# Altium schematic sheet Sheet1.SchDoc: Digital Signal Controller Eval
size D; DrawnBy: Daud Zoss; Engineer: Daud Zoss; Organization: Daud Zoss; Address1: 14955 Avenida Venusto; Address2: Unit 85; Address3: San Diego, California; Address4: 92128 USA; DocumentNumber: N/A; Revision: 0; SheetNumber: 1; SheetTotal: 1
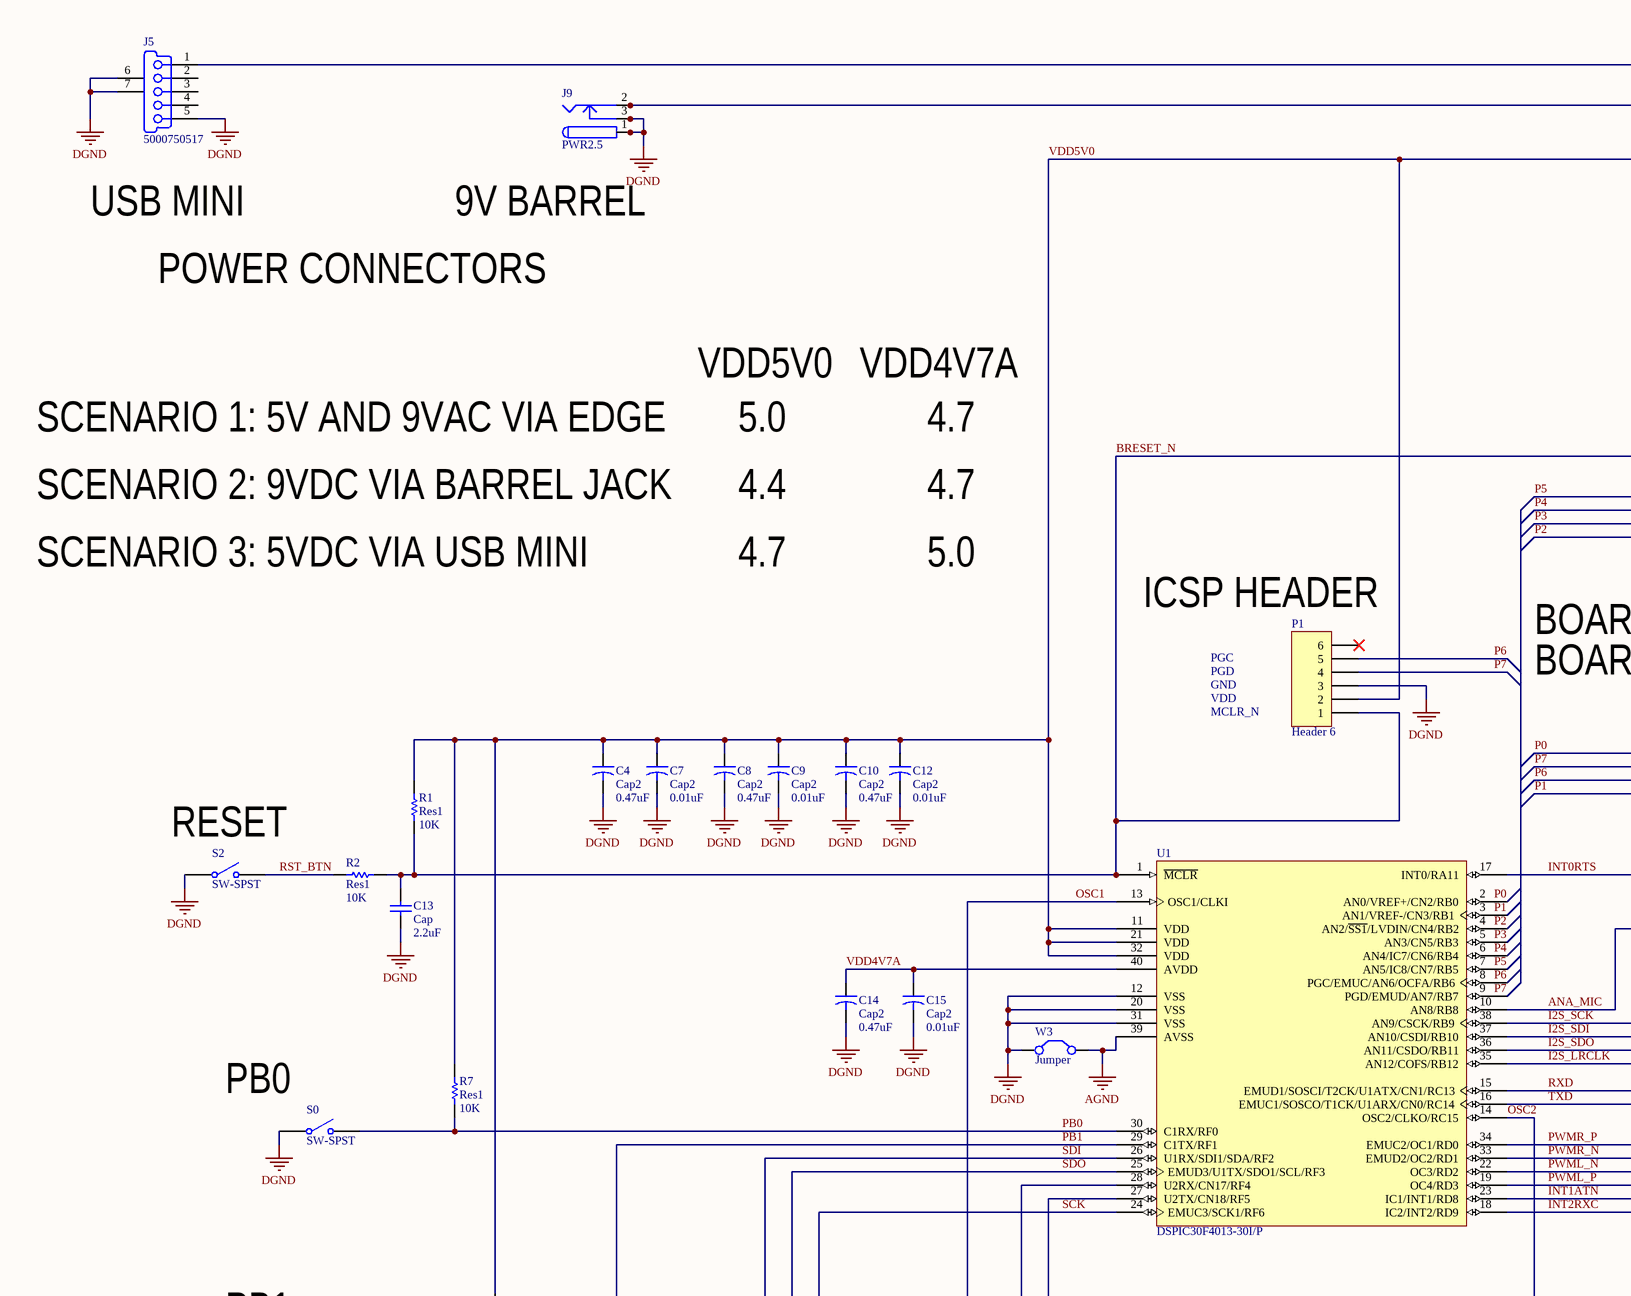
[diagram p0: Sheet1.SchDoc, top left]
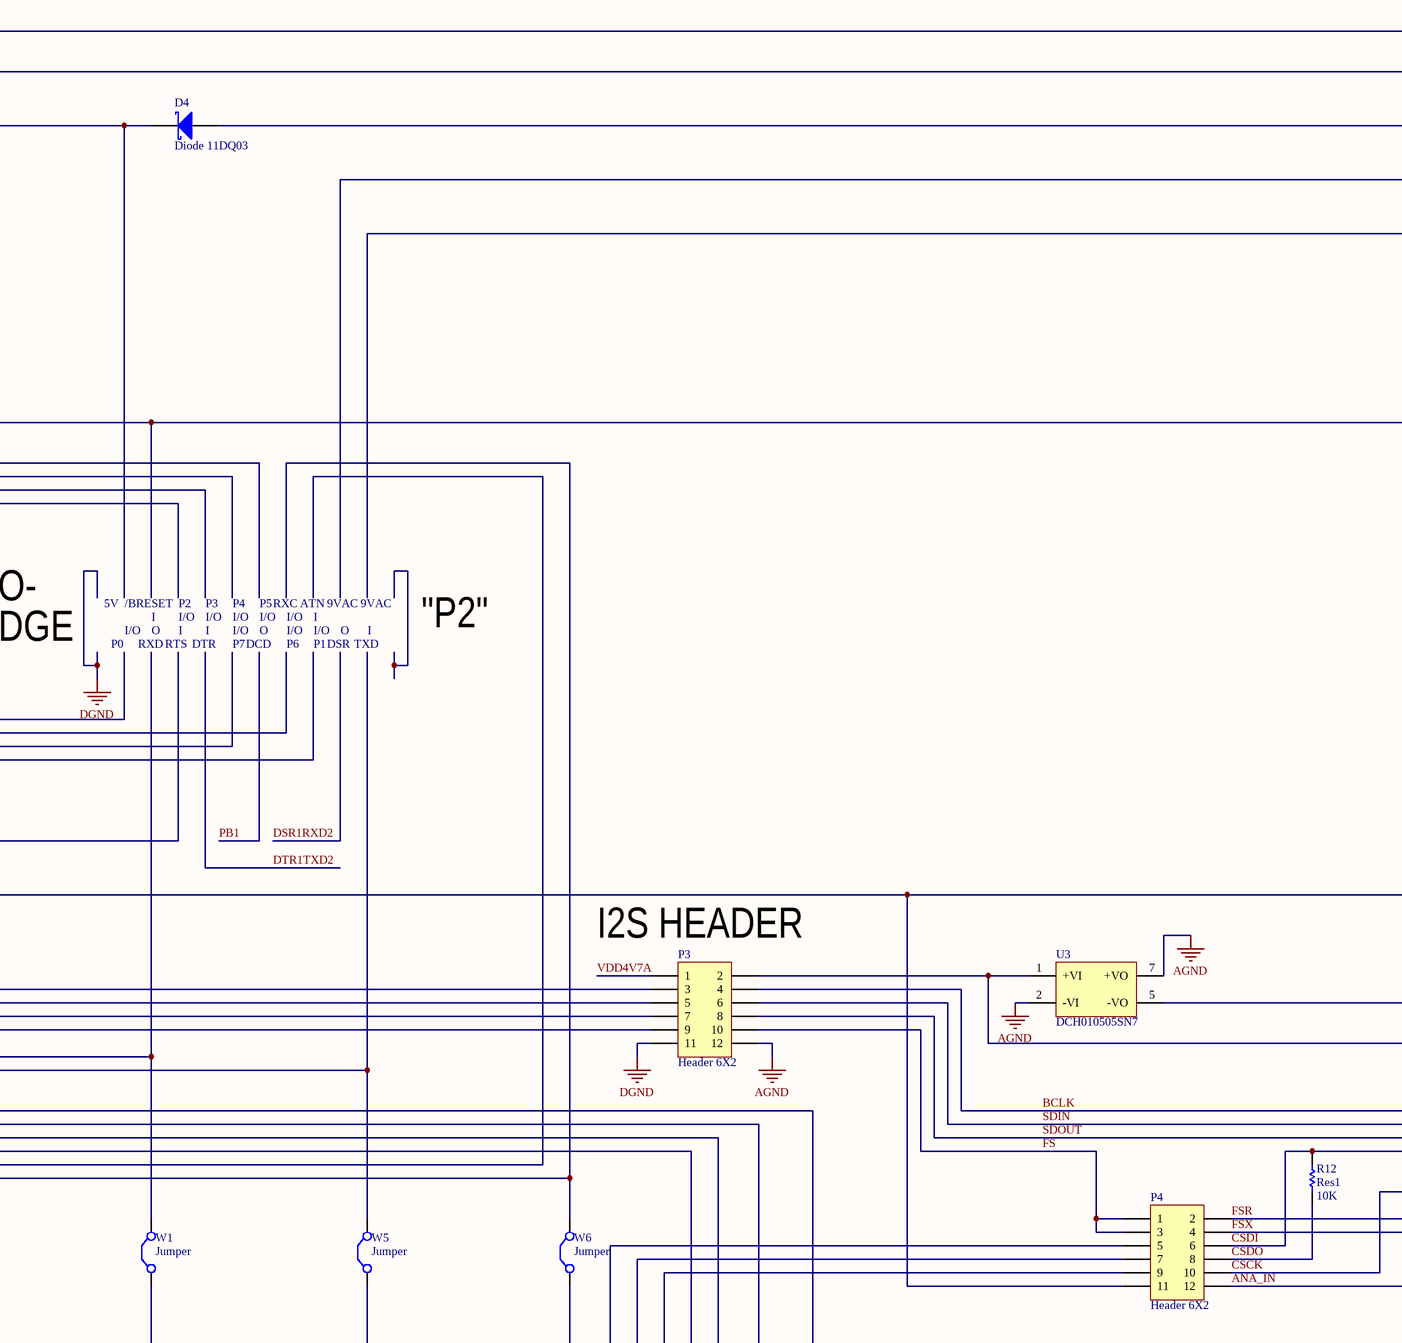
[diagram p1: Sheet1.SchDoc, top middle]
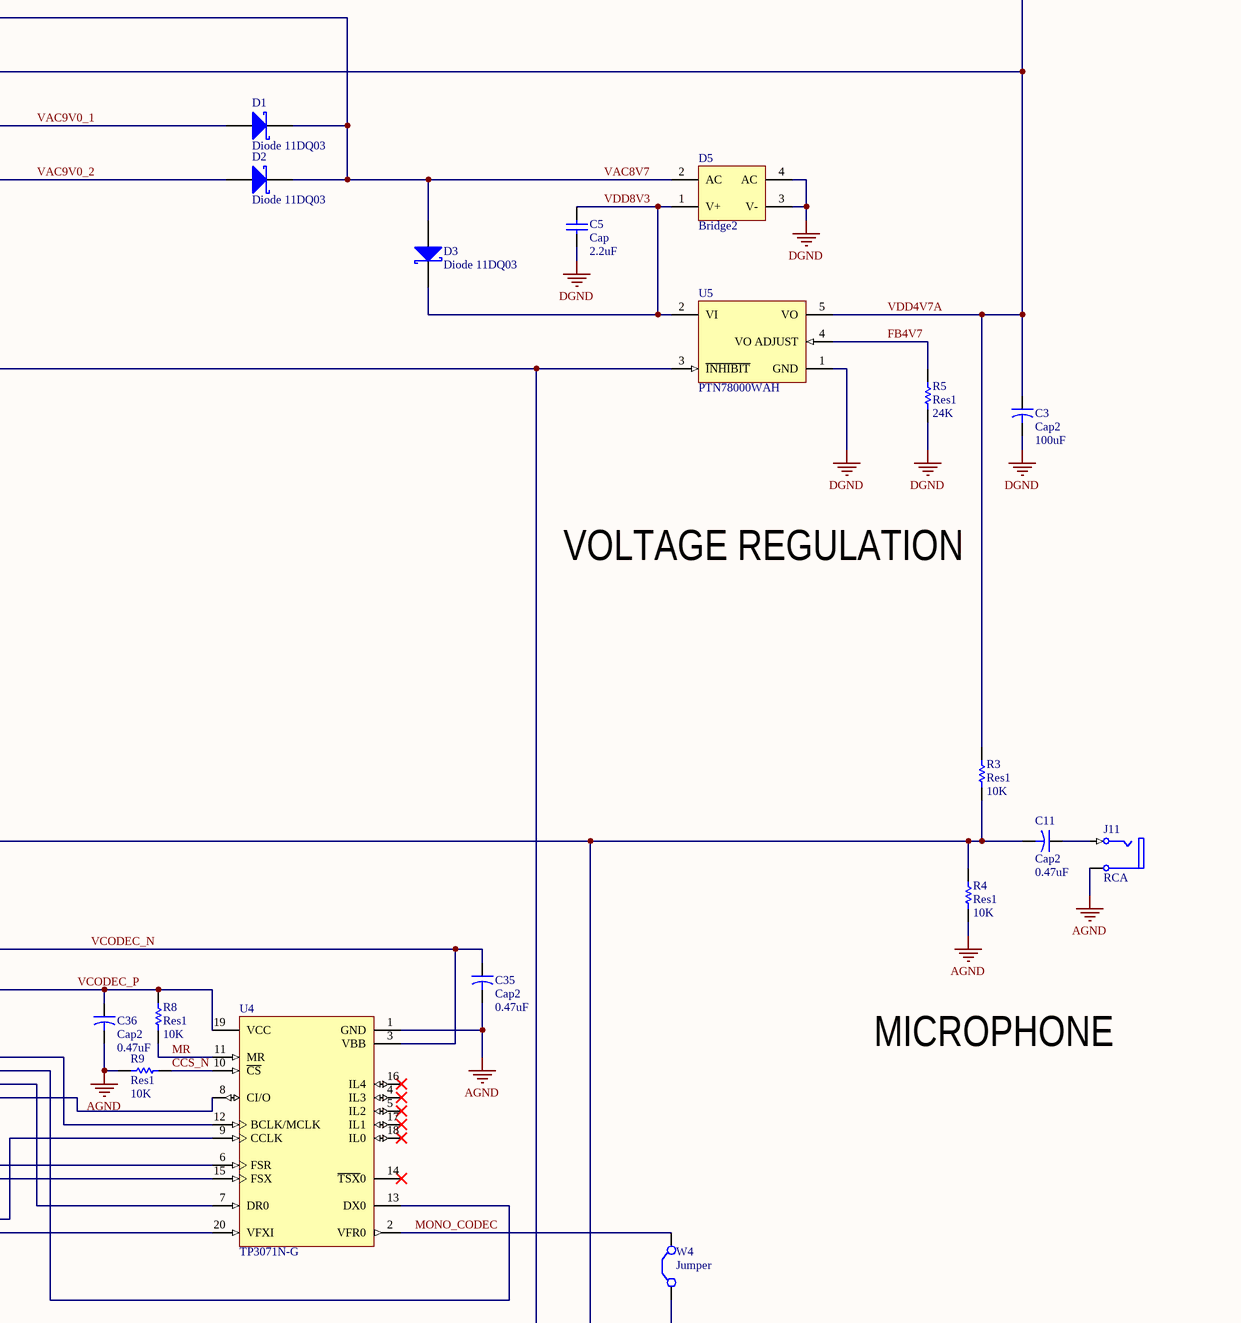
[diagram p2: Sheet1.SchDoc, top right]
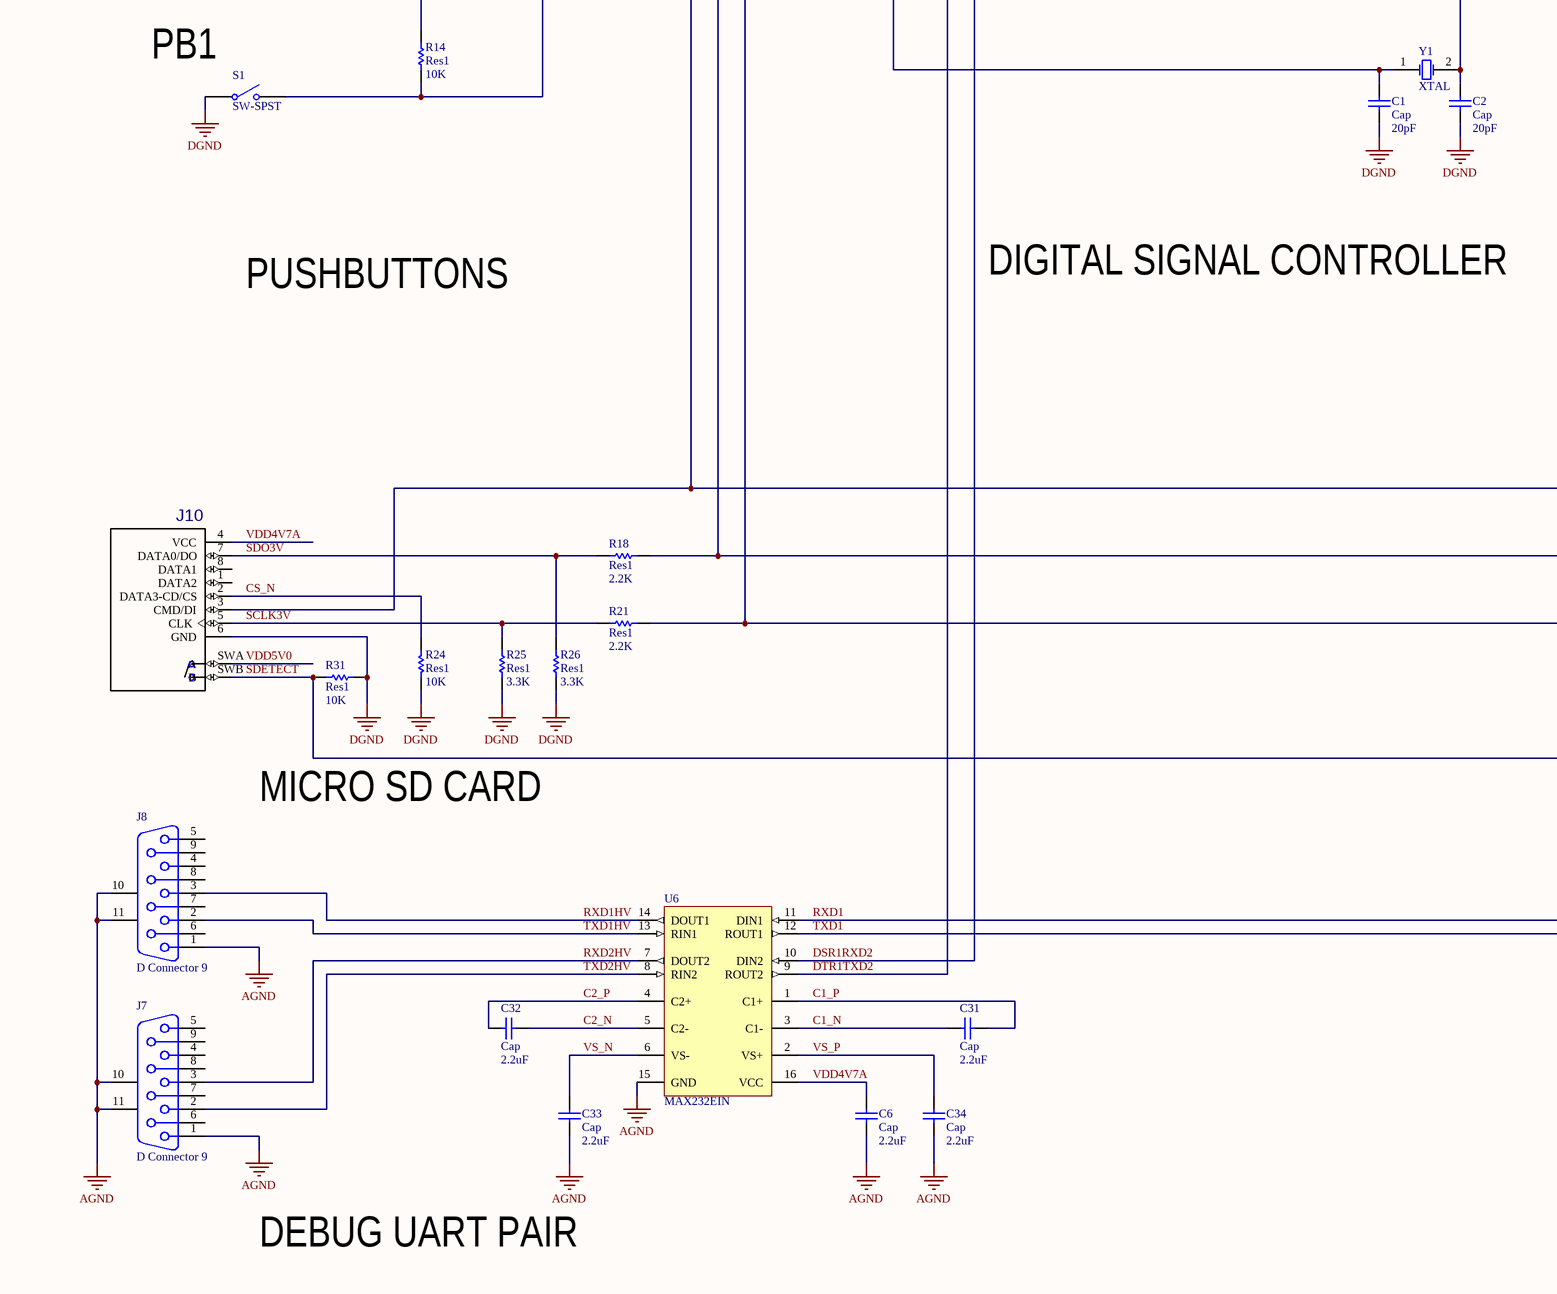
[diagram p3: Sheet1.SchDoc, bottom left]
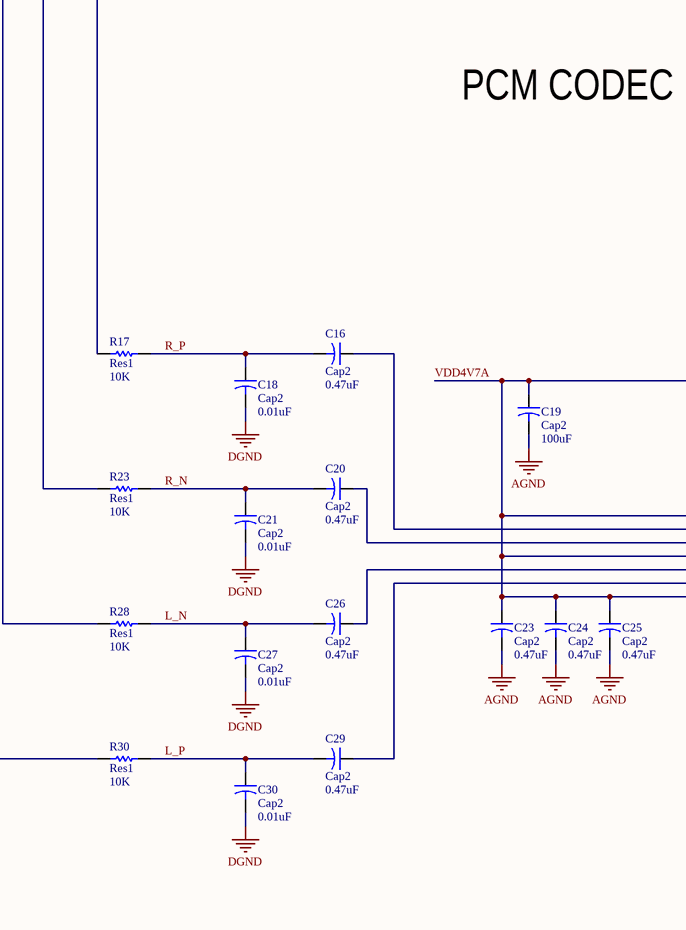
[diagram p4: Sheet1.SchDoc, bottom middle]
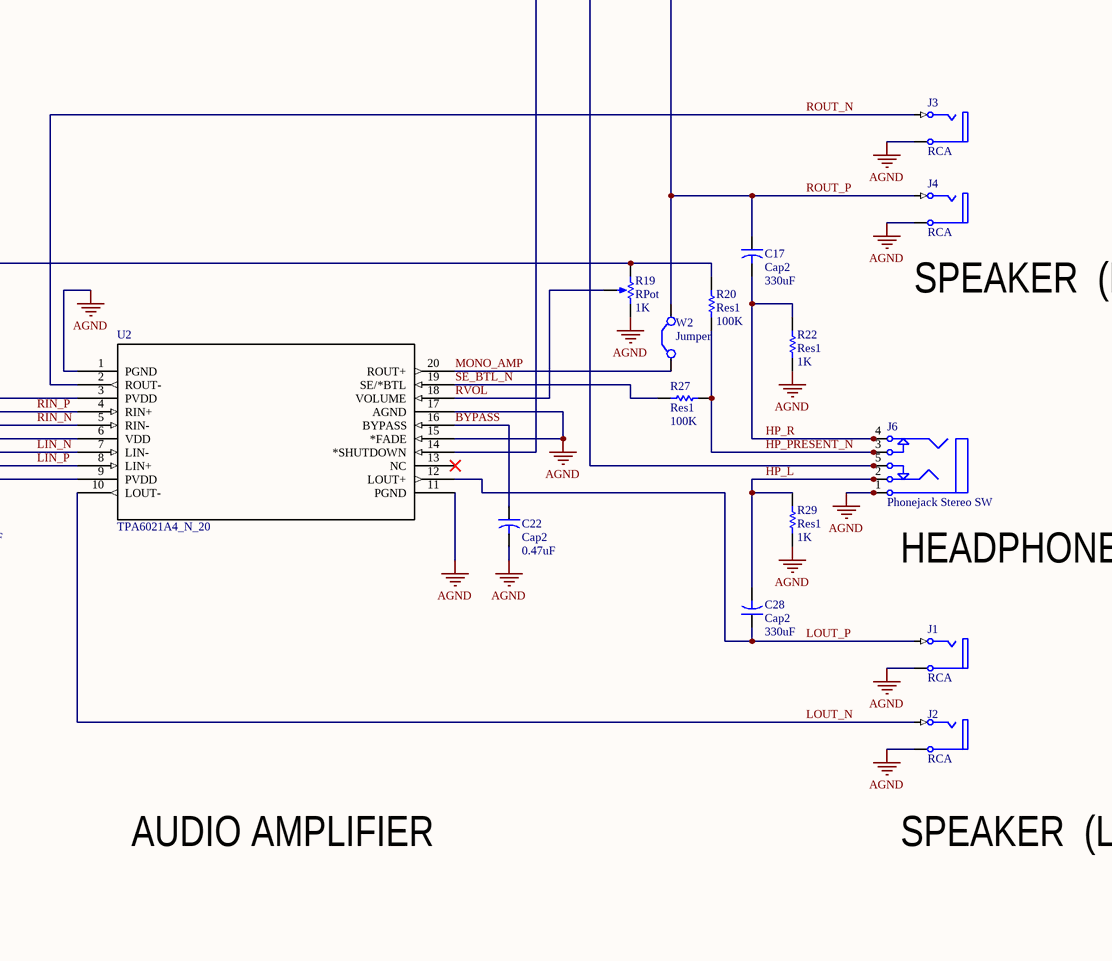
[diagram p5: Sheet1.SchDoc, bottom right]

## Parts
C1  Cap  value 20pF  [RAD-0.3]
C2  Cap  value 20pF  [RAD-0.3]
C3  Cap2  value 100uF  [CAPR5-4X5]
C4  Cap2  value 0.47uF  [CAPR5-4X5]
C5  Cap  value 2.2uF  [RAD-0.3]
C6  Cap  value 2.2uF  [RAD-0.3]
C7  Cap2  value 0.01uF  [CAPR5-4X5]
C8  Cap2  value 0.47uF  [CAPR5-4X5]
C9  Cap2  value 0.01uF  [CAPR5-4X5]
C10  Cap2  value 0.47uF  [CAPR5-4X5]
C11  Cap2  value 0.47uF  [CAPR5-4X5]
C12  Cap2  value 0.01uF  [CAPR5-4X5]
C13  Cap  value 2.2uF  [RAD-0.3]
C14  Cap2  value 0.47uF  [CAPR5-4X5]
C15  Cap2  value 0.01uF  [CAPR5-4X5]
C16  Cap2  value 0.47uF  [CAPR5-4X5]
C17  Cap2  value 330uF  [CAPR5-4X5]
C18  Cap2  value 0.01uF  [CAPR5-4X5]
C19  Cap2  value 100uF  [CAPR5-4X5]
C20  Cap2  value 0.47uF  [CAPR5-4X5]
C21  Cap2  value 0.01uF  [CAPR5-4X5]
C22  Cap2  value 0.47uF  [CAPR5-4X5]
C23  Cap2  value 0.47uF  [CAPR5-4X5]
C24  Cap2  value 0.47uF  [CAPR5-4X5]
C25  Cap2  value 0.47uF  [CAPR5-4X5]
C26  Cap2  value 0.47uF  [CAPR5-4X5]
C27  Cap2  value 0.01uF  [CAPR5-4X5]
C28  Cap2  value 330uF  [CAPR5-4X5]
C29  Cap2  value 0.47uF  [CAPR5-4X5]
C30  Cap2  value 0.01uF  [CAPR5-4X5]
C31  Cap  value 2.2uF  [RAD-0.3]
C32  Cap  value 2.2uF  [RAD-0.3]
C33  Cap  value 2.2uF  [RAD-0.3]
C34  Cap  value 2.2uF  [RAD-0.3]
C35  Cap2  value 0.47uF  [CAPR5-4X5]
C36  Cap2  value 0.47uF  [CAPR5-4X5]
D1  Diode 11DQ03  [DO-204AL]
D2  Diode 11DQ03  [DO-204AL]
D3  Diode 11DQ03  [DO-204AL]
D4  Diode 11DQ03  [DO-204AL]
D5  Bridge2  [D-46_6A]
J1  RCA  [RCA/4.5-H2]
J2  RCA  [RCA/4.5-H2]
J3  RCA  [RCA/4.5-H2]
J4  RCA  [RCA/4.5-H2]
J5  5000750517  [5000750517]
J6  Phonejack Stereo SW  [ST-3150-5N]
J7  D Connector 9  [DSUB1.385-2H9]
J8  D Connector 9  [DSUB1.385-2H9]
J9  PWR2.5  [KLD-0202]
J10  DM3AT-SF-PEJM5  [HRS_DM3AT-SF-PEJM5_DM3AT-SF-PEJM5(Primary)]  (value not drawn)
J11  RCA  [RCA/4.5-H2]
P1  Header 6  [HDR1X6]
P3  Header 6X2  [HDR2X6]
P4  Header 6X2  [HDR2X6]
R1  Res1  value 10K  [AXIAL-0.3]
R2  Res1  value 10K  [AXIAL-0.3]
R3  Res1  value 10K  [AXIAL-0.3]
R4  Res1  value 10K  [AXIAL-0.3]
R5  Res1  value 24K  [AXIAL-0.3]
R7  Res1  value 10K  [AXIAL-0.3]
R8  Res1  value 10K  [AXIAL-0.3]
R9  Res1  value 10K  [AXIAL-0.3]
R12  Res1  value 10K  [AXIAL-0.3]
R14  Res1  value 10K  [AXIAL-0.3]
R17  Res1  value 10K  [AXIAL-0.3]
R18  Res1  value 2.2K  [AXIAL-0.3]
R19  RPot  value 1K  [VR5]
R20  Res1  value 100K  [AXIAL-0.3]
R21  Res1  value 2.2K  [AXIAL-0.3]
R22  Res1  value 1K  [AXIAL-0.3]
R23  Res1  value 10K  [AXIAL-0.3]
R24  Res1  value 10K  [AXIAL-0.3]
R25  Res1  value 3.3K  [AXIAL-0.3]
R26  Res1  value 3.3K  [AXIAL-0.3]
R27  Res1  value 100K  [AXIAL-0.3]
R28  Res1  value 10K  [AXIAL-0.3]
R29  Res1  value 1K  [AXIAL-0.3]
R30  Res1  value 10K  [AXIAL-0.3]
R31  Res1  value 10K  [AXIAL-0.3]
S0  SW-SPST  [SPST-2]
S1  SW-SPST  [SPST-2]
S2  SW-SPST  [SPST-2]
U1  DSPIC30F4013-30I/P  [PDIP600-P40]
U2  TPA6021A4_N_20  [N20]
U3  DCH010505SN7  [TI-EDJ4_V]
U4  TP3071N-G  [N20A]
U5  PTN78000WAH  [TI-EUS5_V]
U6  MAX232EIN  [TI-N16]
W1  Jumper  [RAD-0.2]
W2  Jumper  [RAD-0.2]
W3  Jumper  [RAD-0.2]
W4  Jumper  [RAD-0.2]
W5  Jumper  [RAD-0.2]
W6  Jumper  [RAD-0.2]
Y1  XTAL  [R38]

## Nets
AGND: C6.2 C19.2 C22.2 C23.2 C24.2 C25.2 C33.2 C34.2 C35.2 C36.2 J1.1A(Ground) J2.1A(Ground) J3.1A(Ground) J4.1A(Ground) J6.1 J6.1A J6.1B J7.1 J7.10(MH1) J7.11(MH2) J8.1 J8.10(MH1) J8.11(MH2) J11.1A(Ground) P3.12 R4.2 R9.2 R19.2(BOT) R22.1 R29.1 U1.39(AVSS) U2.1(PGND) U2.11(PGND) U2.15(*FADE) U2.17(AGND) U3.2(-VI) U3.7(+VO) U4.1(GND) U6.15(GND) W3.2(C2)
DGND: C1.1 C2.1 C3.2 C4.2 C5.2 C7.2 C8.2 C9.2 C10.2 C12.2 C13.2 C14.2 C15.2 C18.2 C21.2 C27.2 C30.2 D5.3(V-) D5.4(AC) J5.5(GND) J5.6(MH1) J5.7(MH2) J9.1 J9.1A J9.1B J9.3 J9.3A J9.3B J10.6(GND) P1.3 P3.11 R5.1 R24.1 R25.1 R26.1 R31.2 S0.1(COMMON) S1.1(COMMON) S2.1(COMMON) U1.12(VSS) U1.20(VSS) U1.31(VSS) U5.1(GND) W3.1(C1)
ANA_IN: P4.12 U4.20(VFXI)
ANA_MIC: C11.2 J6.5 J6.5A J6.5B P4.11 R3.2 R4.1 U1.10(AN8/RB8)
BCLK: P3.4 U4.12(BCLK/MCLK)
BRESET_N: C13.1 P1.1 R1.1 R2.1 U1.1(~{MCLR}) U2.14(*SHUTDOWN) U5.3(~{INHIBIT})
BYPASS: C22.1 U2.16(BYPASS)
C1_N: C31.1 U6.3(C1-)
C1_P: C31.2 U6.1(C1+)
C2_N: C32.2 U6.5(C2-)
C2_P: C32.1 U6.4(C2+)
CCS_N: R9.1 U4.10(~{CS})
CS_N: J10.2(DATA3-CD/CS) R24.2
CSCK: P4.10 U4.9(CCLK)
CSDI: P4.6 R12.2 U4.8(CI/O)
CSDO: P4.8 R12.1
DSR1RXD2: U1.27(U2TX/CN18/RF5) U6.10(DIN2)
DTR1TXD2: U1.28(U2RX/CN17/RF4) U6.9(ROUT2)
FB4V7: R5.2 U5.4(VO_ADJUST)
FS: P3.10 P4.1 P4.3
FSR: P4.2 U4.6(FSR)
FSX: P4.4 U4.15(FSX)
HP_L: C28.2 J6.2 J6.2A J6.2B R29.2
HP_PRESENT_N: J6.3 J6.3A J6.3B R20.1 R27.1
HP_R: C17.2 J6.4 J6.4A J6.4B R22.2
I2S_LRCLK: P3.9 U1.35(AN12/COFS/RB12)
I2S_SCK: P3.3 U1.38(AN9/CSCK/RB9)
I2S_SDI: P3.5 U1.37(AN10/CSDI/RB10)
I2S_SDO: P3.7 U1.36(AN11/CSDO/RB11)
INT0RTS: U1.17(INT0/RA11)
INT1ATN: U1.23(IC1/INT1/RD8)
INT2RXC: U1.18(IC2/INT2/RD9) W6.2(C2)
L_N: C26.2 C27.1 R28.2
L_P: C29.2 C30.1 R30.2
LIN_N: C26.1 U2.7(LIN-)
LIN_P: C29.1 U2.8(LIN+)
LOUT_N: J2.2B(Signal) U2.10(LOUT-)
LOUT_P: C28.1 J1.2B(Signal) U2.12(LOUT+)
MONO_AMP: U2.20(ROUT+) W2.1(C1)
MONO_CODEC: U4.2(VFR0) W4.2(C2)
MR: R8.2 U4.11(MR)
OSC1: C1.2 U1.13(OSC1/CLKI) Y1.1(OSC1)
OSC2: C2.2 U1.14(OSC2/CLKO/RC15) Y1.2(OSC2)
P6: P1.5
P7: P1.4
PB0: R7.1 S0.2(NO) U1.30(C1RX/RF0)
PB1: R14.1 S1.2(NO) U1.29(C1TX/RF1)
PWML_N: R28.1 U1.22(OC3/RD2)
PWML_P: R30.1 U1.19(OC4/RD3)
PWMR_N: R23.1 U1.33(EMUD2/OC2/RD1)
PWMR_P: R17.1 U1.34(EMUC2/OC1/RD0)
R_N: C20.2 C21.1 R23.2
R_P: C16.2 C18.1 R17.2
RIN_N: C20.1 U2.5(RIN-)
RIN_P: C16.1 U2.4(RIN+)
ROUT_N: J3.2B(Signal) U2.2(ROUT-)
ROUT_P: C17.1 J4.2B(Signal) W2.2(C2) W4.1(C1)
RST_BTN: R2.2 S2.2(NO)
RVOL: R19.3(TAP) U2.18(VOLUME)
RXD: U1.15(EMUD1/SOSCI/T2CK/U1ATX/CN1/RC13) W1.2(C2)
RXD1: U6.11(DIN1) W1.1(C1)
RXD1HV: J8.3 U6.14(DOUT1)
RXD2HV: J7.3 U6.7(DOUT2)
SCK: P4.9 R21.1 U1.24(EMUC3/SCK1/RF6)
SCLK3V: J10.5(CLK) R21.2 R25.2
SDETECT: J10.SWB(B) R31.1 W6.1(C1)
SDI: J10.3(CMD/DI) P4.5 U1.26(U1RX/SDI1/SDA/RF2)
SDIN: P3.6 U4.13(DX0)
SDO: P4.7 R18.1 U1.25(EMUD3/U1TX/SDO1/SCL/RF3)
SDO3V: J10.7(DATA0/DO) R18.2 R26.2
SDOUT: P3.8 U4.7(DR0)
SE_BTL_N: R27.2 U2.19(SE/*BTL)
TXD: U1.16(EMUC1/SOSCO/T1CK/U1ARX/CN0/RC14) W5.2(C2)
TXD1: U6.12(ROUT1) W5.1(C1)
TXD1HV: J8.2 U6.13(RIN1)
TXD2HV: J7.2 U6.8(RIN2)
VAC8V7: D1.2(K) D2.2(K) D3.1(A) D5.2(AC) J9.2 J9.2A J9.2B
VAC9V0_1: D1.1(A)
VAC9V0_2: D2.1(A)
VCODEC_N: C35.1 U3.5(-VO) U4.3(VBB)
VCODEC_P: C36.1 P3.2 R8.1 U3.1(+VI) U4.19(VCC)
VDD4V7A: C3.1 C6.1 C14.1 C15.1 C19.1 C23.1 C24.1 C25.1 D4.1(A) J5.1(V_BUS) J10.4(VCC) P3.1 R3.1 R19.1(TOP) R20.2 U1.40(AVDD) U2.3(PVDD) U2.6(VDD) U2.9(PVDD) U5.5(VO) U6.16(VCC)
VDD5V0: C4.1 C7.1 C8.1 C9.1 C10.1 C12.1 D4.2(K) J10.SWA(A) P1.2 R1.2 R7.2 R14.2 U1.11(VDD) U1.21(VDD) U1.32(VDD)
VDD8V3: C5.1 D3.2(K) D5.1(V+) U5.2(VI)
VS_N: C33.1 U6.6(VS-)
VS_P: C34.1 U6.2(VS+)
NetC11_1: C11.1 J11.2B(Signal)

Not connected (* = marked no-connect by the designer): J5 2(D-) 3(D+) 4(ID); J7 4 5 6 7 8 9; J8 4 5 6 7 8 9; J10 1(DATA2) 8(DATA1); P1 6*; U1 2(AN0/VREF+/CN2/RB0) 3(AN1/VREF-/CN3/RB1) 4(AN2/~{SS1}/LVDIN/CN4/RB2) 5(AN3/CN5/RB3) 6(AN4/IC7/CN6/RB4) 7(AN5/IC8/CN7/RB5) 8(PGC/EMUC/AN6/OCFA/RB6) 9(PGD/EMUD/AN7/RB7); U2 13(NC)*; U4 4(IL3)* 5(IL2)* 14(~{TSX}0)* 16(IL4)* 17(IL1)* 18(IL0)*

## Notes on the sheet
- USB MINI
- (near J9) 9V BARREL
- POWER CONNECTORS
- VDD5V0
- VDD4V7A
- SCENARIO 1: 5V AND 9VAC VIA EDGE
- 5.0
- 4.7
- SCENARIO 2: 9VDC VIA BARREL JACK
- 4.4
- SCENARIO 3: 5VDC VIA USB MINI
- (near P1) ICSP HEADER
- PGC
- BOARD-TO-
- 5V
- /BRESET
- I/O
- O
- I
- P2
- P3
- P4
- P5
- RXC
- ATN
- 9VAC
- "P2"
- VOLTAGE REGULATION
- PGD
- GND
- VDD
- MCLR_N
- BOARD EDGE
- P0
- RXD
- RTS
- DTR
- P7
- DCD
- P6
- P1
- DSR
- TXD
- (near S2) RESET
- (near P3) I2S HEADER
- (near S0) PB0
- MICROPHONE
- (near S1) PB1
- DIGITAL SIGNAL CONTROLLER
- PCM CODEC
- PUSHBUTTONS
- (near J4) SPEAKER  (R)
- MICRO SD CARD
- (near J6) HEADPHONE
- AUDIO AMPLIFIER
- SPEAKER  (L)
- DEBUG UART PAIR
- Labels drawn without touching a wire or pin: P0, P1, P2, P3, P4, P5, P6, P7
- Title
- Size:
- Date:
- File:
- D
- Number:
- Time:
- Revision:
- Sheet
- of

## Library data of the parts
C1 C2 C5 C6 C13 C31-C34 = Cap: Capacitor; Published: 8-Jun-2000; LatestRevisionDate: 17-Jul-2002; LatestRevisionNote: Re-released for DXP Platform.; PackageReference: RAD-0.3; Publisher: Altium Limited; PackageDescription: Radial Cap, Thru-Hole; 2 Leads; 0.3 in Pin Spacing
C3 C4 C7-C12 C14-C30 C35 C36 = Cap2: Capacitor; Published: 23-Sep-2002; PackageReference: CAPR5-4X5; Publisher: Altium Limited; PackageDescription: Capacitor; 2 Leads
D1-D4 = Diode 11DQ03: Schottky Rectifier; Published: 8-Jun-2000; LatestRevisionDate: 17-Jul-2002; LatestRevisionNote: Re-released for DXP Platform.; DatasheetVersion: Dec-1997; PackageReference: DO-204AL; Publisher: Altium Limited; PackageDescription: Diode, Axial; Body 5.2 x 2.7 mm (LxDia. max), Lead Dia. 0.86 mm (max); Code_JEDEC: DO-204-AL; ComponentLink1Description: Manufacturer Link; ComponentLink1URL: http://www.irf.com/; ComponentLink2Description: Datasheet; ComponentLink2URL: http://www.irf.com/product-info/datasheets/data/11dq03.pdf
D5 = Bridge2: Diode Bridge; Published: 24-Mar-1999; LatestRevisionDate: 17-Jul-2002; LatestRevisionNote: Re-released for DXP Platform.; PackageReference: D-46_6A; Publisher: Altium Limited; PackageDescription: Bridge Rectifier; 4 Terminals; Body 16.8 x 16.8 mm (typ); Pitch 10.67 mm
J1-J4 J11 = RCA: RCA Phono Jack, Right Angle, Thru-Hole, Snap-In; PCB_Layout: Complies with manufacturer's recommendation.; DrillAndSlotSize: Corresponds to nominal value.; Published: 15-Jul-2004; LatestRevisionDate: 15-Jul-2004; LatestRevisionNote: Component Replaced.; DatasheetDocument: 7-Jul-2000; PackageDocument: 7-Jul-2000; PackageReference: 161; Publisher: Altium Limited; ComponentLink1Description: Manufacturer Link; ComponentLink1URL: http://www.mouser.com/kobiconn/
J5 = 5000750517: USB On-The-Go (OTG) Mini-B Receptacle, Right Angle, Thru-Hole, 0.80mm (.031") Pitch, Solder Tails & Shell Tabs with Dimples; PCB_Layout: Complies with Manufacturer's Recommendation.; Published: 30-May-2008; DatasheetVersion: rev0, Mar-2004; PackageVersion: rev0, Mar-2004; PackageReference: 5000750517; Publisher: Altium Limited; PackageDescription: USB Mini-B, Type 2, Thru-Hole; 5 Position; Vertical, Body 7.7 x 4.2 x 7.7 mm (LxWxH); ComponentLink1Description: Manufacturer Link; ComponentLink1URL: http://www.molex.com/; ComponentLink2Description: Datasheet; ComponentLink2URL: http://www.molex.com/pdm_docs/sd/5000750517_sd.pdf
J6 = Phonejack Stereo SW: 3-Conductor Jack with 2 break contacts (normals) and 2 auxiliary make contacts; Published: 5-Jan-2004; LatestRevisionDate: 17-Dec-2003; LatestRevisionNote: PCB Footprint replaced.; DatasheetDocument: 07-Mar-2000; Publisher: Altium Limited; ComponentLink1Description: Manufacturer Link; ComponentLink1URL: http://domino.kycon.com/internet/Products.html
J7 J8 = D Connector 9: Receptacle Assembly, 9 Position, Right Angle; PackageDocument: O; Positions: 9; Published: 15-Jun-2001; LatestRevisionDate: 17-Jul-2002; LatestRevisionNote: Re-released for DXP Platform.; DatasheetDocument: 1-Sep-1999; PackageReference: 788750; Publisher: Altium Limited; Orientation: Right Angle; Gender: Receptacle
J9 = PWR2.5: Low Voltage Power Supply Connector; Published: 17-Dec-2003; DatasheetDocument: 09-May-2002; Publisher: Altium Limited; ComponentLink1Description: Manufacturer Link; ComponentLink1URL: http://domino.kycon.com/internet/Products.html
J10 = DM3AT-SF-PEJM5: DM3%20Series%208%20Position%20Right%20Angle%20SMT%20Push%20Push%20Ejection%20MicroSD%20Card%20Connector; MF: Hirose; Package: None; Availability: Good; MP: DM3AT-SF-PEJM5; Price: 1.97 USD; Value: *
P1 = Header 6: Header, 6-Pin; LatestRevisionDate: 17-Jul-2002; LatestRevisionNote: Re-released for DXP Platform.; Publisher: Altium Limited
P3 P4 = Header 6X2: Header, 6-Pin, Dual row; LatestRevisionDate: 17-Jul-2002; LatestRevisionNote: Re-released for DXP Platform.; Publisher: Altium Limited
R1-R5 R7-R9 R12 R14 R17 R18 R20-R31 = Res1: Resistor; Published: 8-Jun-2000; LatestRevisionDate: 17-Jul-2002; LatestRevisionNote: Re-released for DXP Platform.; PackageReference: AXIAL-0.3; Publisher: Altium Limited; PackageDescription: Axial Device, Thru-Hole; 2 Leads; 0.3 in Pin Spacing
R19 = RPot: Potentiometer; Sim Note: Enter the Resistance value and the set point into parameter fields.; Set Position: 0.5; Published: 8-Jun-2000; LatestRevisionDate: 17-Jul-2002; LatestRevisionNote: Re-released for DXP Platform.; PackageReference: VR5; Publisher: Altium Limited; PackageDescription: Variable Resistor, Thru-Hole; 3 Leads
S0-S2 = SW-SPST: Single-Pole, Single-Throw Switch; Published: 24-Mar-1999; LatestRevisionDate: 17-Jul-2002; LatestRevisionNote: Re-released for DXP Platform.; PackageReference: SPST-2; Publisher: Altium Limited; PackageDescription: Switch; 2 Leads
U1 = DSPIC30F4013-30I/P: High-Performance 16-bit Digital Signal Controller, 48 KB Flash, 2 KB SRAM, 1 KB EEPROM, 40-Pin PDIP, Industrial Temperature; Manufacturer: Microchip; DatasheetVersion: revF, Apr-2008; PackageVersion: revBB, Aug-2009; PackageReference: PDIP600-P40; PackageDescription: 40-Lead Plastic Dual In-Line (P) - 600 mil Body [PDIP]; Supplier 1: Digi-Key; Supplier Part Number 1: DSPIC30F4013-30IP-ND; Supplier 2: Farnell; Supplier Part Number 2: 1439599; Supplier 3: Newark; Supplier Part Number 3: 71J3770; Supplier 4: Mouser; Supplier Part Number 4: 579-DSPF401330IP; Mounting Technology: Through Hole; PartNumber: DSPIC30F4013-30I/P; ComponentLink1Description: Manufacturer URL; ComponentLink1URL: http://www.microchip.com/; ComponentLink2Description: Datasheet; ComponentLink2URL: http://ww1.microchip.com/downloads/en/DeviceDoc/70138F.pdf; ComponentLink3Description: Package Specification; ComponentLink3URL: http://www.microchip.com/stellent/groups/techpub_sg/documents/packagingspec/en012702.pdf
U2 = TPA6021A4_N_20: Imported; Vendor: Texas Instruments; PACKAGE_DESIGNATOR: N; PIN_COUNT: 20; FAMILY_NAME: AUDIO SUBSYSTEM; INDUSTRY_STD_PKG_TYPE: PDIP; Manufacturer_Part_Number: tpa6021a4_n_20; GENERIC_PART_NUMBER: TPA6021A4; Datasheet URL: http://www.ti.com/lit/gpn/TPA6021A4; Manufacturer: Texas Instruments; RefDes: RefDes; Type: DEV; Value: Value
U3 = DCH010505SN7: Miniature, 1 W, 3 kVDC Isolated DC-DC Converter, -40 to 85 degC, 4-pin Module (EDJ4), Pb-Free (RoHS); Manufacturer: Texas Instruments; Iout(Max)(A): 0.2; Regulated Outputs(#): 1; SubFamily: 1 W & 2 W Miniature; Vin(Max)(V): 5.5; Vin(Min)(V): 4.5; DatasheetVersion: SBVS073H; PackageVersion: 4207975-2/C; PackageReference: EDJ4; PackageDescription: 4-Pin Plastic Special Shape, Body 10.15 x 19.56 mm; Supplier 1: Digi-Key; Supplier Part Number 1: 296-20638-ND; Supplier 2: Farnell; Supplier Part Number 2: 1754260; Supplier 3: Newark; Supplier Part Number 3: 28M9234; Supplier 4: Mouser; Supplier Part Number 4: 595-DCH010505SN7; Eco-Plan: Pb-Free (RoHS); Vout(Max)(V): 5.5; Vout(Min)(V): 4.5; Mounting Technology: Through Hole; PartNumber: DCH010505SN7; ComponentLink1Description: Manufacturer URL; ComponentLink1URL: http://www.ti.com/; ComponentLink2Description: Datasheet; ComponentLink2URL: http://www.ti.com/general/docs/lit/getliterature.tsp?genericPartNumber=DCH010505S&fileType=pdf; ComponentLink3Description: Package Specification; ComponentLink3URL: http://www.ti.com/lit/ml/mpds293b/mpds293b.pdf; ComponentLink4Description: URL Link1; ComponentLink4URL: Samples URL:http://www.ti.com/product/tps55010#samples
U4 = TP3071N-G: COMBO II Programmable PCM CODEC/Filter, 20-pin MDIP; Manufacturer: National Semiconductor; PackageTopMarking: NSUZXYYTTE#*TP3071N-G*COMBOR; PowerWise: N; CompType: Analog IC; High-Reliability: Y; DatasheetVersion: Apr-1994; PackageVersion: revG, Nov-1984; PackageReference: N20A; PackageDescription: Molded Dip (N) 20 Lead; PartNumber: TP3071N-G; RoHS: N; PinCount: 20; Code_JEDEC: MS-001-AD; ComponentLink1Description: Manufacturer URL; ComponentLink1URL: http://www.national.com/; ComponentLink2Description: TP3071 Datasheet; ComponentLink2URL: http://www.national.com/ds/TP/TP3071.pdf; ComponentLink3Description: TP3071 Web Page; ComponentLink3URL: http://www.national.com/pf/TP/TP3071.html; ComponentLink4Description: N20A Package Page; ComponentLink4URL: http://www.national.com/packaging/folders/n20a.html
U5 = PTN78000WAH: 1.5 A, Wide-Input Adjustable Switching Regulator, -40 to 85 degC, 5-pin Module (EUS5), Pb-Free (RoHS); Manufacturer: Texas Instruments; Iout(Max)(A): 1.5; Regulated Outputs(#): 1; SubFamily: Non-Isolated POL; Vin(Max)(V): 36; Vin(Min)(V): 7; VO Adjustable: TRUE; Vout(Max)(V): 12.6; Vout(Min)(V): 2.5; DatasheetVersion: SLTS230C; PackageVersion: 4204990-2/C; PackageReference: EUS5; PackageDescription: 5-Pin Plastic Special Shape, Body 12.57 x 18.92 mm; Supplier 1: Digi-Key; Supplier Part Number 1: 296-20506-ND; Supplier 2: Farnell; Supplier Part Number 2: 1564908; Supplier 3: Newark; Supplier Part Number 3: 65J6317; Supplier 4: Mouser; Supplier Part Number 4: 595-PTN78000WAH; Eco-Plan: Pb-Free (RoHS); Mounting Technology: Through Hole; PartNumber: PTN78000WAH; ComponentLink1Description: Manufacturer URL; ComponentLink1URL: http://www.ti.com/; ComponentLink2Description: Datasheet; ComponentLink2URL: http://www.ti.com/general/docs/lit/getliterature.tsp?genericPartNumber=PTN78000W&fileType=pdf; ComponentLink3Description: Package Specification; ComponentLink3URL: http://www.ti.com/litv/pdf/mpds139b; ComponentLink4Description: URL Link1; ComponentLink4URL: Samples URL:http://www.ti.com/product/ptn78000w#samples
U6 = MAX232EIN: Dual RS-232 Driver / Receiver with IEC61000-4-2 Protection, -40 to 85 degC, 16-Pin PDIP (N),  Pb-Free (RoHS); Drivers Per Package: 2; Supply Voltage(s)(V): 5; ESD HBM(kV): +/-15; ICC(Max)(mA): 10; Single Supply: TRUE; DatasheetVersion: SLLS723B; PackageVersion: revE, Dec-2002; PackageReference: N16; PackageDescription: 16-Pin Plastic Dual-In-Line Package, Row Spacing 7.62 mm, Pitch 2.54 mm; SubFamily: RS-232; Receivers Per Package: 2; RS-232: TRUE; IEC-61000-4-2 SUPPORT: TRUE; ComponentLink1Description: Manufacturer URL; ComponentLink1URL: www.ti.com; ComponentLink2Description: Datasheet; ComponentLink2URL: http://www.ti.com/general/docs/lit/getliterature.tsp?genericPartNumber=MAX232E&fileType=pdf; ComponentLink3Description: Package Specification; ComponentLink3URL: http://www.ti.com/litv/pdf/mpdi002c
W1-W6 = Jumper: Jumper Wire; Published: 24-Mar-1999; LatestRevisionDate: 17-Jul-2002; LatestRevisionNote: Re-released for DXP Platform.; PackageReference: RAD-0.2; Publisher: Altium Limited; PackageDescription: Radial Cap, Thru-Hole; 2 Leads; 0.2 in Pin Spacing
Y1 = XTAL: Crystal Oscillator; Published: 8-Jun-2000; LatestRevisionDate: 17-Jul-2002; LatestRevisionNote: Re-released for DXP Platform.; PackageReference: R38; Publisher: Altium Limited; PackageDescription: Crystal, Thru-Hole; 2 Leads; Body 3.1 x 8.2 mm (Dia.xH)